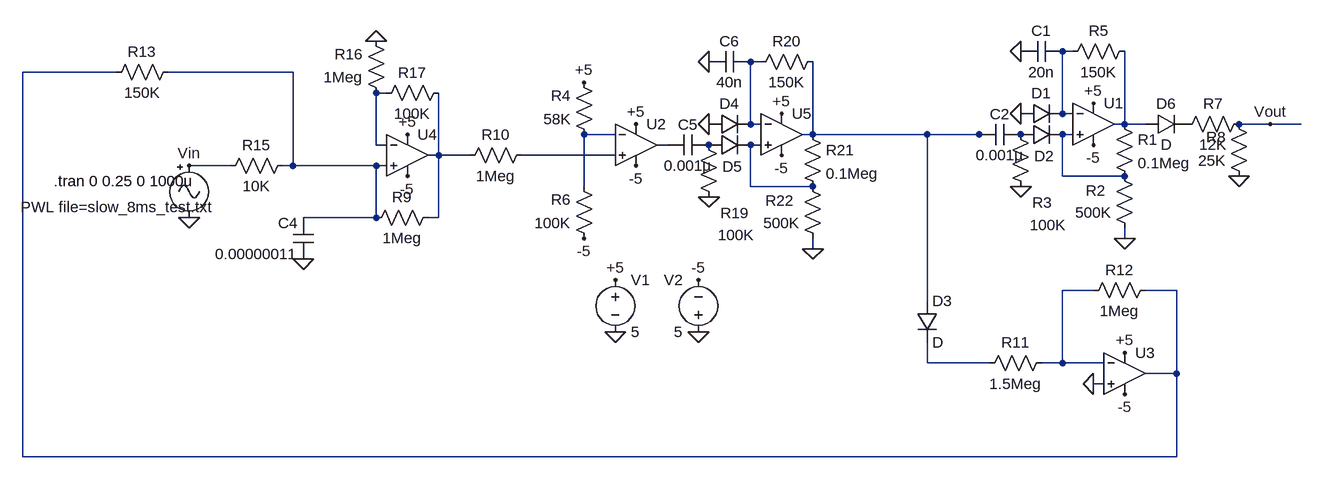
[diagram p0: schematic Leak-5_normal_7ms_btw6-8ms_1.1mkF.asc]
Leak-5_normal_7ms_btw6-8ms_1.1mkF.asc, the LTspice schematic file:
Version 4
SHEET 1 2784 1552
WIRE 720 -336 704 -336
WIRE 240 -320 224 -320
WIRE -752 -304 -896 -304
WIRE -480 -304 -672 -304
WIRE -336 -272 -352 -272
WIRE 704 -240 704 -336
WIRE 720 -240 704 -240
WIRE 224 -224 224 -320
WIRE 240 -224 224 -224
WIRE 800 -224 800 -336
WIRE 800 -224 784 -224
WIRE 832 -224 800 -224
WIRE 1024 -224 976 -224
WIRE 1072 -224 1024 -224
WIRE 16 -208 -32 -208
WIRE 320 -208 320 -320
WIRE 320 -208 304 -208
WIRE 496 -208 320 -208
WIRE 576 -208 496 -208
WIRE 592 -208 576 -208
WIRE 720 -208 704 -208
WIRE -352 -192 -352 -272
WIRE -336 -192 -352 -192
WIRE 96 -192 80 -192
WIRE 240 -192 224 -192
WIRE -256 -176 -256 -272
WIRE -256 -176 -272 -176
WIRE -208 -176 -256 -176
WIRE 16 -176 -128 -176
WIRE -576 -160 -640 -160
WIRE -480 -160 -480 -304
WIRE -480 -160 -496 -160
WIRE -352 -160 -480 -160
WIRE -336 -160 -352 -160
WIRE 704 -144 704 -208
WIRE 800 -144 704 -144
WIRE -32 -128 -32 -208
WIRE 224 -128 224 -192
WIRE 320 -128 224 -128
WIRE -352 -80 -352 -160
WIRE -352 -80 -464 -80
WIRE -256 -80 -256 -176
WIRE -256 -80 -272 -80
WIRE 800 -48 800 -64
WIRE 320 -32 320 -48
WIRE 752 32 704 32
WIRE 880 32 832 32
WIRE 496 48 496 -208
WIRE 496 144 496 112
WIRE 592 144 496 144
WIRE 704 144 704 32
WIRE 704 144 672 144
WIRE 768 144 704 144
WIRE 880 160 880 32
WIRE 880 160 832 160
WIRE 768 176 752 176
WIRE -896 288 -896 -304
WIRE 880 288 880 160
WIRE 880 288 -896 288
FLAG -640 -80 0
FLAG 272 -240 +5
FLAG 272 -176 -5
FLAG 160 -224 0
FLAG 160 -320 0
FLAG 160 -112 0
FLAG 320 -32 0
FLAG -304 -208 +5
FLAG -304 -144 -5
FLAG -464 -16 0
FLAG -352 -352 0
FLAG 16 96 0
FLAG 144 96 0
FLAG 144 16 -5
FLAG 16 16 +5
FLAG 48 -224 +5
FLAG 48 -160 -5
FLAG -32 -48 -5
FLAG -32 -288 +5
FLAG 752 -256 +5
FLAG 752 -192 -5
FLAG 640 -240 0
FLAG 640 -336 0
FLAG 640 -128 0
FLAG 800 -48 0
FLAG 976 -144 0
FLAG -640 -160 Vin
FLAG 1024 -224 Vout
FLAG 800 128 +5
FLAG 800 192 -5
FLAG 752 176 0
SYMBOL res -480 -176 R90
WINDOW 0 0 56 VBottom 2
WINDOW 3 32 56 VTop 2
SYMATTR InstName R15
SYMATTR Value 10K
SYMBOL Opamps\\UniversalOpamp2 272 -208 R0
SYMATTR InstName U5
SYMBOL diode 160 -208 R270
WINDOW 0 32 32 VTop 2
WINDOW 3 0 32 Invisible 2
SYMATTR InstName D4
SYMBOL diode 160 -176 R270
WINDOW 0 -33 36 VTop 2
WINDOW 3 0 32 Invisible 2
SYMATTR InstName D5
SYMBOL res 304 -224 R0
SYMATTR InstName R21
SYMATTR Value 0.1Meg
SYMBOL res 336 -32 R180
WINDOW 0 45 74 Left 2
WINDOW 3 36 40 Left 2
SYMATTR InstName R22
SYMATTR Value 500K
SYMBOL res 144 -208 R0
WINDOW 0 34 121 Left 2
WINDOW 3 30 155 Left 2
SYMATTR InstName R19
SYMATTR Value 100K
SYMBOL res 336 -336 R90
WINDOW 0 0 56 VBottom 2
WINDOW 3 32 56 VTop 2
SYMATTR InstName R20
SYMATTR Value 150K
SYMBOL cap 224 -336 R90
WINDOW 0 0 32 VBottom 2
WINDOW 3 32 32 VTop 2
SYMATTR InstName C6
SYMATTR Value 40n
SYMBOL cap 160 -208 R90
WINDOW 0 0 32 VBottom 2
WINDOW 3 32 32 VTop 2
SYMATTR InstName C5
SYMATTR Value 0.001µ
SYMBOL Opamps\\UniversalOpamp2 -304 -176 R0
SYMATTR InstName U4
SYMBOL cap -448 -16 R180
WINDOW 0 24 56 Left 2
WINDOW 3 24 8 Left 2
SYMATTR InstName C4
SYMATTR Value 0.00000011
SYMBOL res -240 -288 R90
WINDOW 0 0 56 VBottom 2
WINDOW 3 32 56 VTop 2
SYMATTR InstName R17
SYMATTR Value 100K
SYMBOL res -336 -256 R180
WINDOW 0 36 76 Left 2
WINDOW 3 36 40 Left 2
SYMATTR InstName R16
SYMATTR Value 1Meg
SYMBOL voltage 16 0 R0
WINDOW 123 0 0 Left 2
WINDOW 39 0 0 Left 2
SYMATTR InstName V1
SYMATTR Value 5
SYMBOL voltage 144 112 R180
WINDOW 0 24 96 Left 2
WINDOW 3 24 16 Left 2
WINDOW 123 0 0 Left 2
WINDOW 39 0 0 Left 2
SYMATTR InstName V2
SYMATTR Value 5
SYMBOL Misc\\signal -640 -176 R0
WINDOW 0 24 16 Invisible 2
WINDOW 3 -259 80 Left 2
WINDOW 123 0 0 Left 2
WINDOW 39 0 0 Left 2
SYMATTR InstName V3
SYMATTR Value PWL file=slow_8ms_test.txt
SYMBOL Opamps\\UniversalOpamp2 48 -192 R0
SYMATTR InstName U2
SYMBOL res -16 -192 R180
WINDOW 0 36 76 Left 2
WINDOW 3 36 40 Left 2
SYMATTR InstName R4
SYMATTR Value 58K
SYMBOL res -16 -32 R180
WINDOW 0 36 76 Left 2
WINDOW 3 36 40 Left 2
SYMATTR InstName R6
SYMATTR Value 100K
SYMBOL Opamps\\UniversalOpamp2 752 -224 R0
SYMATTR InstName U1
SYMBOL diode 640 -224 R270
WINDOW 0 32 32 VTop 2
WINDOW 3 0 32 Invisible 2
SYMATTR InstName D1
SYMBOL diode 640 -192 R270
WINDOW 0 -33 36 VTop 2
WINDOW 3 0 32 Invisible 2
SYMATTR InstName D2
SYMBOL res 784 -240 R0
SYMATTR InstName R1
SYMATTR Value 0.1Meg
SYMBOL res 816 -48 R180
WINDOW 0 45 74 Left 2
WINDOW 3 36 40 Left 2
SYMATTR InstName R2
SYMATTR Value 500K
SYMBOL res 624 -224 R0
WINDOW 0 34 121 Left 2
WINDOW 3 30 155 Left 2
SYMATTR InstName R3
SYMATTR Value 100K
SYMBOL res 816 -352 R90
WINDOW 0 0 56 VBottom 2
WINDOW 3 32 56 VTop 2
SYMATTR InstName R5
SYMATTR Value 150K
SYMBOL cap 704 -352 R90
WINDOW 0 0 32 VBottom 2
WINDOW 3 32 32 VTop 2
SYMATTR InstName C1
SYMATTR Value 20n
SYMBOL cap 640 -224 R90
WINDOW 0 0 32 VBottom 2
WINDOW 3 32 32 VTop 2
SYMATTR InstName C2
SYMATTR Value 0.001µ
SYMBOL diode 832 -208 R270
WINDOW 0 32 32 VTop 2
WINDOW 3 0 32 VBottom 2
SYMATTR InstName D6
SYMBOL res 992 -240 R90
WINDOW 0 0 56 VBottom 2
WINDOW 3 32 56 VTop 2
SYMATTR InstName R7
SYMATTR Value 12K
SYMBOL res 992 -128 R180
WINDOW 0 36 76 Left 2
WINDOW 3 36 40 Left 2
SYMATTR InstName R8
SYMATTR Value 25K
SYMBOL res -256 -96 R90
WINDOW 0 0 56 VBottom 2
WINDOW 3 32 56 VTop 2
SYMATTR InstName R9
SYMATTR Value 1Meg
SYMBOL res -112 -192 R90
WINDOW 0 0 56 VBottom 2
WINDOW 3 32 56 VTop 2
SYMATTR InstName R10
SYMATTR Value 1Meg
SYMBOL diode 480 48 R0
SYMATTR InstName D3
SYMBOL res 688 128 R90
WINDOW 0 0 56 VBottom 2
WINDOW 3 32 56 VTop 2
SYMATTR InstName R11
SYMATTR Value 1.5Meg
SYMBOL Opamps\\UniversalOpamp2 800 160 R0
SYMATTR InstName U3
SYMBOL res 848 16 R90
WINDOW 0 0 56 VBottom 2
WINDOW 3 32 56 VTop 2
SYMATTR InstName R12
SYMATTR Value 1Meg
SYMBOL res -656 -320 R90
WINDOW 0 0 56 VBottom 2
WINDOW 3 32 56 VTop 2
SYMATTR InstName R13
SYMATTR Value 150K
TEXT -848 -136 Left 2 !.tran 0 0.25 0 1000u

The netlist it stands for:
* Leak-5_normal_7ms_btw6-8ms_1.1mkF.asc
R15 N004 Vin 10K
XU5 N011 N002 +5 -5 N008 level.2 Avol=1Meg GBW=10Meg Slew=10Meg ilimit=25m rail=0 Vos=0 phimargin=45 en=0 enk=0 in=0 ink=0 Rin=500Meg  ; pins IN+ IN- V+ V- OUT
D4 0 N002 D
D5 P001 N011 D
R21 N008 N011 0.1Meg
R22 0 N011 500K
R19 P001 0 100K
R20 N008 N002 150K
C6 N002 0 40n
C5 P001 N010 0.001µ
XU4 N004 N005 +5 -5 N012 level.2 Avol=1Meg GBW=10Meg Slew=10Meg ilimit=25m rail=0 Vos=0 phimargin=45 en=0 enk=0 in=0 ink=0 Rin=500Meg  ; pins IN+ IN- V+ V- OUT
C4 0 N004 0.00000011
R17 N012 N005 100K
R16 N005 0 1Meg
V1 +5 0 5
V2 0 -5 5
V3 Vin 0 PWL file=slow_8ms_test.txt
XU2 N013 N007 +5 -5 N010 level.2 Avol=1Meg GBW=10Meg Slew=10Meg ilimit=25m rail=0 Vos=0 phimargin=45 en=0 enk=0 in=0 ink=0 Rin=500Meg  ; pins IN+ IN- V+ V- OUT
R4 N007 +5 58K
R6 -5 N007 100K
XU1 N009 N001 +5 -5 N006 level.2 Avol=1Meg GBW=10Meg Slew=10Meg ilimit=25m rail=0 Vos=0 phimargin=45 en=0 enk=0 in=0 ink=0 Rin=500Meg  ; pins IN+ IN- V+ V- OUT
D1 0 N001 D
D2 P002 N009 D
R1 N006 N009 0.1Meg
R2 0 N009 500K
R3 P002 0 100K
R5 N006 N001 150K
C1 N001 0 20n
C2 P002 N008 0.001µ
D6 N006 P003 D
R7 Vout P003 12K
R8 0 Vout 25K
R9 N012 N004 1Meg
R10 N013 N012 1Meg
D3 N008 N015 D
R11 N014 N015 1.5Meg
XU3 0 N014 +5 -5 N003 level.2 Avol=1Meg GBW=10Meg Slew=10Meg ilimit=25m rail=0 Vos=0 phimargin=45 en=0 enk=0 in=0 ink=0 Rin=500Meg  ; pins IN+ IN- V+ V- OUT
R12 N003 N014 1Meg
R13 N004 N003 150K
.model D D
.lib standard.dio
.tran 0 0.25 0 1000u
.lib UniversalOpamps2.sub
.backanno
.end